# Altium schematic sheet POWER_REGULATORS_CARRIER.SchDoc: POWER REGULATORS
size A3; Author: Silvio Navaretti; CompanyName: ARDUINO; DrawnBy: Silvio Navaretti; Engineer: Silvio Navaretti; Organization: ARDUINO; SheetNumber: 40; SheetTotal: 51; RevAuthor: Silvio Navaretti
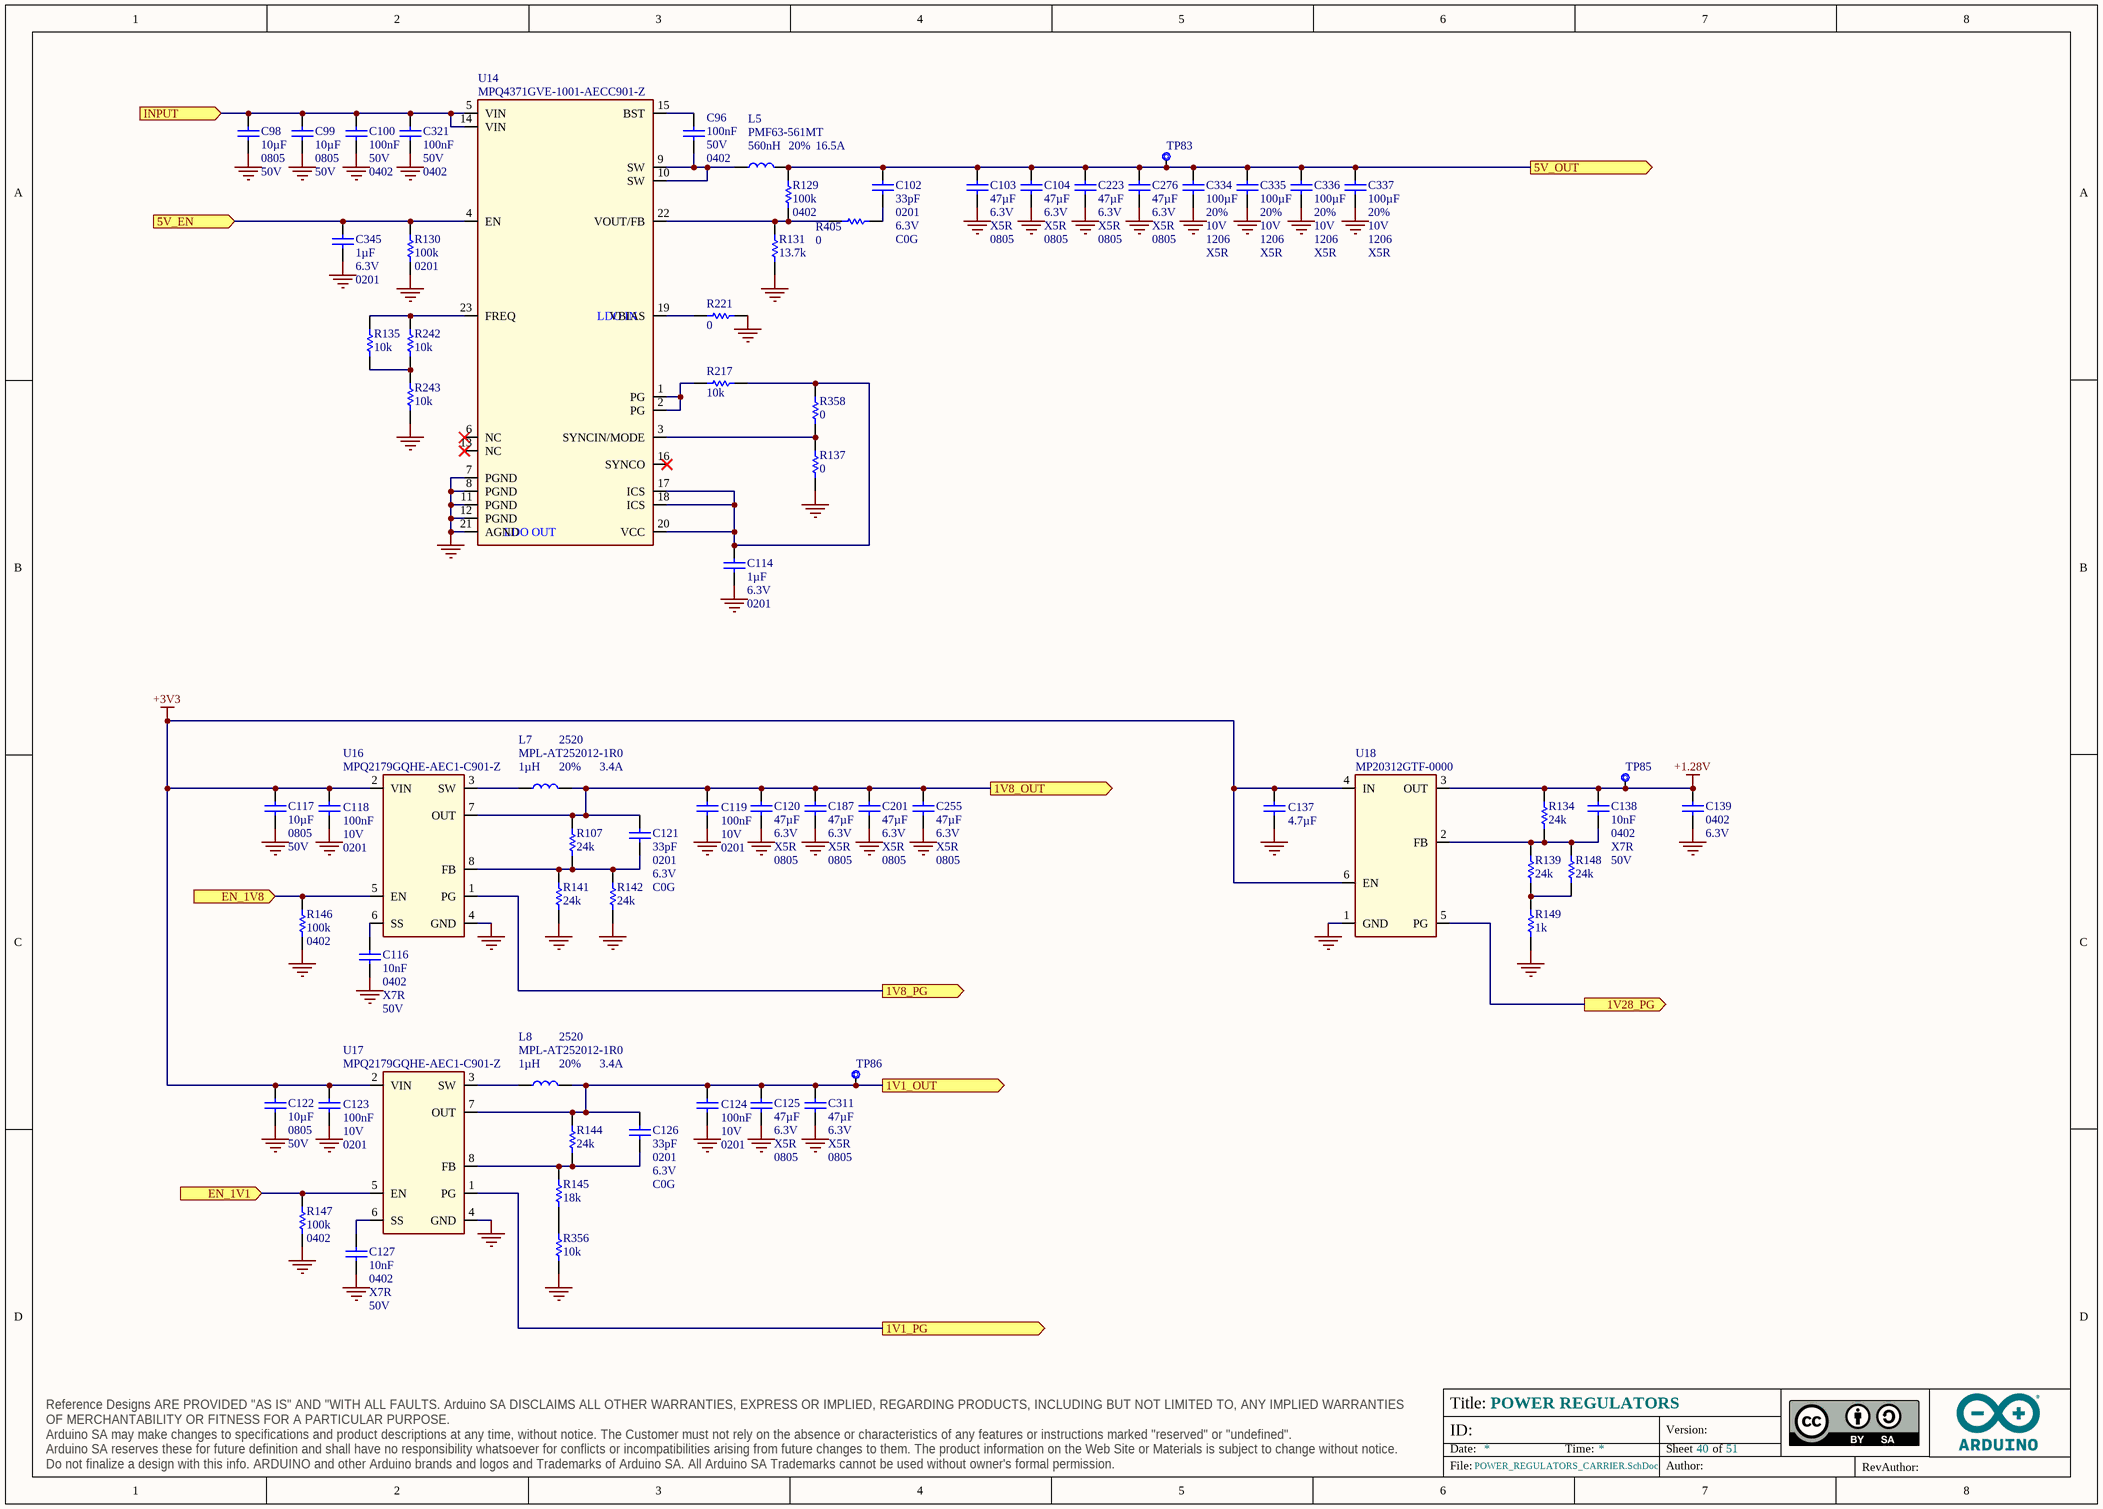
[diagram p0: POWER_REGULATORS_CARRIER.SchDoc]

## Parts
C96  value 100nF  Voltage: 50V  Case Code (Imperial): 0402  [CAP-0402]  (hidden comment: GRM155R61H104KE19D)
C98  value 10µF  Case Code (Imperial): 0805  Voltage: 50V  [CAP-0805]  (hidden comment: GRM21BR61H106ME43L)
C99  value 10µF  Case Code (Imperial): 0805  Voltage: 50V  [CAP-0805]  (hidden comment: GRM21BR61H106ME43L)
C100  value 100nF  Voltage: 50V  Case Code (Imperial): 0402  [CAP-0402]  (hidden comment: GRM155R61H104KE19D)
C102  value 33pF  Case Code (Imperial): 0201  Voltage: 6.3V  Dielectric: C0G  [CAP-0201]  (hidden comment: GJM0335C0J330JB01J)
C103  value 47µF  Voltage: 6.3V  Dielectric: X5R  Case Code (Imperial): 0805  [CAP-0805]  (hidden comment: C0805C476M9PAC7800)
C104  value 47µF  Voltage: 6.3V  Dielectric: X5R  Case Code (Imperial): 0805  [CAP-0805]  (hidden comment: C0805C476M9PAC7800)
C114  value 1µF  Voltage: 6.3V  Case Code (Imperial): 0201  [CAP-0201]  (hidden comment: GRM033R60J105MEA2D)
C116  value 10nF  Case Code (Imperial): 0402  Dielectric: X7R  Voltage: 50V  [CAP-0402]  (hidden comment: C1005B103K500NT)
C117  value 10µF  Case Code (Imperial): 0805  Voltage: 50V  [CAP-0805]  (hidden comment: GRM21BR61H106ME43L)
C118  value 100nF  Voltage: 10V  Case Code (Imperial): 0201  [CAP-0201]  (hidden comment: CL03A104KP3NNNC)
C119  value 100nF  Voltage: 10V  Case Code (Imperial): 0201  [CAP-0201]  (hidden comment: CL03A104KP3NNNC)
C120  value 47µF  Voltage: 6.3V  Dielectric: X5R  Case Code (Imperial): 0805  [CAP-0805]  (hidden comment: C0805C476M9PAC7800)
C121  value 33pF  Case Code (Imperial): 0201  Voltage: 6.3V  Dielectric: C0G  [CAP-0201]  (hidden comment: GJM0335C0J330JB01J)
C122  value 10µF  Case Code (Imperial): 0805  Voltage: 50V  [CAP-0805]  (hidden comment: GRM21BR61H106ME43L)
C123  value 100nF  Voltage: 10V  Case Code (Imperial): 0201  [CAP-0201]  (hidden comment: CL03A104KP3NNNC)
C124  value 100nF  Voltage: 10V  Case Code (Imperial): 0201  [CAP-0201]  (hidden comment: CL03A104KP3NNNC)
C125  value 47µF  Voltage: 6.3V  Dielectric: X5R  Case Code (Imperial): 0805  [CAP-0805]  (hidden comment: C0805C476M9PAC7800)
C126  value 33pF  Case Code (Imperial): 0201  Voltage: 6.3V  Dielectric: C0G  [CAP-0201]  (hidden comment: GJM0335C0J330JB01J)
C127  value 10nF  Case Code (Imperial): 0402  Dielectric: X7R  Voltage: 50V  [CAP-0402]  (hidden comment: C1005B103K500NT)
C137  value 4.7µF  [CAP-0402]  (hidden comment: C1005A475M6R3NT)
C138  value 10nF  Case Code (Imperial): 0402  Dielectric: X7R  Voltage: 50V  [CAP-0402]  (hidden comment: C1005B103K500NT)
C139  Case Code (Imperial): 0402  Voltage: 6.3V  [CAP-0402]  (hidden comment: C1005A475M6R3NT)
C187  value 47µF  Voltage: 6.3V  Dielectric: X5R  Case Code (Imperial): 0805  [CAP-0805]  (hidden comment: C0805C476M9PAC7800)
C201  value 47µF  Voltage: 6.3V  Dielectric: X5R  Case Code (Imperial): 0805  [CAP-0805]  (hidden comment: C0805C476M9PAC7800)
C223  value 47µF  Voltage: 6.3V  Dielectric: X5R  Case Code (Imperial): 0805  [CAP-0805]  (hidden comment: C0805C476M9PAC7800)
C255  value 47µF  Voltage: 6.3V  Dielectric: X5R  Case Code (Imperial): 0805  [CAP-0805]  (hidden comment: C0805C476M9PAC7800)
C276  value 47µF  Voltage: 6.3V  Dielectric: X5R  Case Code (Imperial): 0805  [CAP-0805]  (hidden comment: C0805C476M9PAC7800)
C311  value 47µF  Voltage: 6.3V  Dielectric: X5R  Case Code (Imperial): 0805  [CAP-0805]  (hidden comment: C0805C476M9PAC7800)
C321  value 100nF  Voltage: 50V  Case Code (Imperial): 0402  [CAP-0402]  (hidden comment: GRM155R61H104KE19D)
C334  value 100µF  Tolerance: 20%  Voltage: 10V  Case Code (Imperial): 1206  Dielectric: X5R  [CAP-1206]  (hidden comment: GRM31CR61A107MEA8L)
C335  value 100µF  Tolerance: 20%  Voltage: 10V  Case Code (Imperial): 1206  Dielectric: X5R  [CAP-1206]  (hidden comment: GRM31CR61A107MEA8L)
C336  value 100µF  Tolerance: 20%  Voltage: 10V  Case Code (Imperial): 1206  Dielectric: X5R  [CAP-1206]  (hidden comment: GRM31CR61A107MEA8L)
C337  value 100µF  Tolerance: 20%  Voltage: 10V  Case Code (Imperial): 1206  Dielectric: X5R  [CAP-1206]  (hidden comment: GRM31CR61A107MEA8L)
C345  value 1µF  Voltage: 6.3V  Case Code (Imperial): 0201  [CAP-0201]  (hidden comment: GRM033R60J105MEA2D)
L5  PMF63-561MT  Inductance: 560nH  IRMS: 16.5A  Tolerance: 20%  [PMF63]
L7  MPL-AT252012-1R0  Tolerance: 20%  Case Code (Metric): 2520  Inductance: 1µH  IRMS: 3.4A  [INDUCTOR 2520]
L8  MPL-AT252012-1R0  Tolerance: 20%  Case Code (Metric): 2520  Inductance: 1µH  IRMS: 3.4A  [INDUCTOR 2520]
R107  value 24k  [RES-0201]  (hidden comment: RC0201FR-0724KL)
R129  value 100k  Case Code (Imperial): 0402  [RES-0402]  (hidden comment: CRCW0402100KFKEDC)
R130  value 100k  Case Code (Imperial): 0201  [RES-0201]  (hidden comment: RC0201FR-07100KL)
R131  value 13.7k  [RES-0201]  (hidden comment: RC0201FR-0713K7L)
R134  value 24k  [RES-0201]  (hidden comment: RC0201FR-0724KL)
R135  value 10k  [RES-0201]  (hidden comment: RC0201FR-0710KL)
R137  value 0  [RES-0201]  (hidden comment: CRCW02010000Z0ED)
R139  value 24k  [RES-0201]  (hidden comment: RC0201FR-0724KL)
R141  value 24k  [RES-0201]  (hidden comment: RC0201FR-0724KL)
R142  value 24k  [RES-0201]  (hidden comment: RC0201FR-0724KL)
R144  value 24k  [RES-0201]  (hidden comment: RC0201FR-0724KL)
R145  value 18k  [RES-0201]  (hidden comment: RC0201FR-0718KL)
R146  value 100k  Case Code (Imperial): 0402  [RES-0402]  (hidden comment: CRCW0402100KFKEDC)
R147  value 100k  Case Code (Imperial): 0402  [RES-0402]  (hidden comment: CRCW0402100KFKEDC)
R148  value 24k  [RES-0201]  (hidden comment: RC0201FR-0724KL)
R149  value 1k  [RES-0201]  (hidden comment: RC0201FR-071KL)
R217  value 10k  [RES-0201]  (hidden comment: RC0201FR-0710KL)
R221  value 0  [RES-0201]  (hidden comment: CRCW02010000Z0ED)
R242  value 10k  [RES-0201]  (hidden comment: RC0201FR-0710KL)
R243  value 10k  [RES-0201]  (hidden comment: RC0201FR-0710KL)
R356  value 10k  [RES-0201]  (hidden comment: RC0201FR-0710KL)
R358  value 0  [RES-0201]  (hidden comment: CRCW02010000Z0ED)
R405  value 0  [RES-0201]  (hidden comment: CRCW02010000Z0ED)
TP83  Test point 1.00mm  [TP-1.00MM]  (value not drawn)  (no BOM)
TP85  Test point 1.00mm  [TP-1.00MM]  (value not drawn)  (no BOM)
TP86  Test point 1.00mm  [TP-1.00MM]  (value not drawn)  (no BOM)
U14  MPQ4371GVE-1001-AECC901-Z  [MPQ4371GVE-1001-AECC901-Z]
U16  MPQ2179GQHE-AEC1-C901-Z  [MPS QFN8 pitch 0.5mm 1.5x2x1mm]
U17  MPQ2179GQHE-AEC1-C901-Z  [MPS QFN8 pitch 0.5mm 1.5x2x1mm]
U18  MP20312GTF-0000  [SOT563]

## Ports
1V1_OUT (out), 1V1_PG (out), 1V8_OUT (out), 1V8_PG (out), 1V28_PG (out), 5V_EN (in), 5V_OUT (out), EN_1V1 (in), EN_1V8 (in), INPUT (in)

## Nets
+1.28V: C138.1 C139.1 R134.1 TP85.X U18.3(OUT)
+3V3: C117.2 C118.2 C122.2 C123.2 C137.2 U16.2(VIN) U17.2(VIN) U18.4(IN) U18.6(EN)
GND: C98.2 C99.2 C100.2 C103.1 C104.1 C114.1 C116.2 C117.1 C118.1 C119.1 C120.1 C122.1 C123.1 C124.1 C125.1 C127.2 C137.1 C139.2 C187.1 C201.1 C223.1 C255.1 C276.1 C311.1 C321.2 C334.2 C335.2 C336.2 C337.2 C345.1 R130.2 R131.1 R137.1 R141.1 R142.1 R146.2 R147.2 R149.2 R221.1 R243.1 R356.1 U14.7(PGND) U14.8(PGND) U14.11(PGND) U14.12(PGND) U14.21(AGND) U16.4(GND) U17.4(GND) U18.1(GND)
1V1_OUT: C124.2 C125.2 C126.2 C311.2 L8.2 R144.2 TP86.X U17.7(OUT) ; port 1V1_OUT
1V1_PG: U17.1(PG) ; port 1V1_PG
1V8_OUT: C119.2 C120.2 C121.2 C187.2 C201.2 C255.2 L7.2 R107.2 U16.7(OUT) ; port 1V8_OUT
1V8_PG: U16.1(PG) ; port 1V8_PG
1V28_PG: U18.5(PG) ; port 1V28_PG
5V_EN: C345.2 R130.1 U14.4(EN) ; port 5V_EN
5V_OUT: C102.2 C103.2 C104.2 C223.2 C276.2 C334.1 C335.1 C336.1 C337.1 L5.2 R129.1 TP83.X ; port 5V_OUT
EN_1V1: R147.1 U17.5(EN) ; port EN_1V1
EN_1V8: R146.1 U16.5(EN) ; port EN_1V8
INPUT: C98.1 C99.1 C100.1 C321.1 U14.5(VIN) U14.14(VIN) ; port INPUT
NetC96_1: C96.1 U14.15(BST)
NetC96_2: C96.2 L5.1 U14.9(SW) U14.10(SW)
NetC102_1: C102.1 R405.2
NetC114_2: C114.2 R217.1 R358.2 U14.17(ICS) U14.18(ICS) U14.20(VCC)
NetC116_1: C116.1 U16.6(SS)
NetC121_1: C121.1 R107.1 R141.2 R142.2 U16.8(FB)
NetC126_1: C126.1 R144.1 R145.2 U17.8(FB)
NetC127_1: C127.1 U17.6(SS)
NetC138_2: C138.2 R134.2 R139.2 R148.2 U18.2(FB)
NetL7_1: L7.1 U16.3(SW)
NetL8_1: L8.1 U17.3(SW)
NetR129_2: R129.2 R131.2 R405.1 U14.22(VOUT/FB)
NetR135_1: R135.1 R242.1 R243.2
NetR135_2: R135.2 R242.2 U14.23(FREQ)
NetR137_2: R137.2 R358.1 U14.3(SYNCIN/MODE)
NetR139_1: R139.1 R148.1 R149.1
NetR145_1: R145.1 R356.2
NetR217_2: R217.2 U14.1(PG) U14.2(PG)
NetR221_2: R221.2 U14.19(VBIAS)

Not connected (* = marked no-connect by the designer): U14 6(NC)* 13(NC)* 16(SYNCO)*

## Notes on the sheet
- Title:
- ID:
- Date:
- Time:
- Version:
- Sheet
- of
- RevAuthor:
- Reference Designs ARE PROVIDED "AS IS" AND "WITH ALL FAULTS. Arduino SA DISCLAIMS ALL OTHER WARRANTIES, EXPRESS OR IMPLIED, REGARDING PRODUCTS, INCLUDING BUT NOT LIMITED TO, ANY IMPLIED WARRANTIES OF MERCHANTABILITY OR FITNESS FOR A PARTICULAR PURPOSE.
  Arduino SA may make changes to specifications and product descriptions at any time, without notice. The Customer must not rely on the absence or characteristics of any features or instructions marked "reserved" or "undefined".
  Arduino SA reserves these for future definition and shall have no responsibility whatsoever for conflicts or incompatibilities arising from future changes to them. The product information on the Web Site or Materials is subject to change without notice.
  Do not finalize a design with this info. ARDUINO and other Arduino brands and logos and Trademarks of Arduino SA. All Arduino SA Trademarks cannot be used without owner's formal permission.
- File:
- Author:
- (in symbol U0503-A.7) LDO IN; LDO OUT

## Library data of the parts
C96 C100 C321 = C0015-A.14: CAP CHIP 0402 100nF 10% 50V X5R; Manufacturer: Murata; Code Arduino: A5141; Part Number: GRM155R61H104KE19D; Dielectric: X5R; Tolerance: 10%; Technology: Ceramic
C98 C99 C117 C122 = C0158-A.3: CAP CHIP 0805 10uF 20% 50V X5R; Manufacturer: Murata Electronics; Code Arduino: C0158; Tolerance: 20%; Dielectric: X5R; Technology: SMD; Part Number: GRM21BR61H106ME43L
C102 C121 C126 = C0114-A.6: CAP CHIP 0201 33pF 5% 6.3V C0G; Manufacturer: Murata Electronics; Code Arduino: C0114; Technology: Ceramic; Tolerance: 5%; Part Number: GJM0335C0J330JB01J
C103 C104 C120 C125 C187 C201 C223 C255 C276 C311 = C0199-A.1: CAP CHIP 0805 47uF 20% 6.3V X5R; Manufacturer: KEMET; Code Arduino: C0199; Technology: Ceramic; Tolerance: 20%; Part Number: C0805C476M9PAC7800
C114 C345 = C0002-A.15: CAP CHIP 0201 1uF 20% 6.3V X5R; Manufacturer: Murata; Code Arduino: A5520; Tolerance: 20%; Dielectric: X5R; Part Number: GRM033R60J105MEA2D; Technology: Ceramic
C116 C127 C138 = C0009-A.15: CAP CHIP 0402 10nF 10% 50V X7R; Manufacturer: Hottech; Code Arduino: 0165; Manufacturer 2: Murata Electronics; Part Number: C1005B103K500NT; Tolerance: 10%; Part number 2: CC0402KRX7R9BB103; Manufacturer 3: YAGEO; Technology: Ceramic
C118 C119 C123 C124 = C0113-A.6: CAP CHIP 0201 100nF 10% 10V X5R; Manufacturer: Samsung Electro-Mechanics; Code Arduino: C0113; Technology: Ceramic; Part Number: CL03A104KP3NNNC; Dielectric: X5R; Tolerance: 10%
C137 = C0037-A.14: CAP CHIP 0402 4.7uF 20% 6V3 X5R; Manufacturer: Hottech; Code Arduino: 0833; Voltage: 6.3V; Dielectric: X5R; Technology: Ceramic; Part Number: C1005A475M6R3NT; Manufacturer 2: Samsung Electro-Mechanics; Case Code (Imperial): 0402; Tolerance: 20%; Manufacturer 3: Murata Electronics; Part number 3: GRM155R60J475ME47D; Part number 2: CL05A475KQ5NRNC
C139 = C0037-A.14: CAP CHIP 0402 4.7uF 20% 6V3 X5R; Manufacturer: Hottech; Value: 4.7µF; Code Arduino: 0833; Dielectric: X5R; Technology: Ceramic; Part Number: C1005A475M6R3NT; Manufacturer 2: Samsung Electro-Mechanics; Tolerance: 20%; Manufacturer 3: Murata Electronics; Part number 3: GRM155R60J475ME47D; Part number 2: CL05A475KQ5NRNC
C334-C337 = C0166-A.1: CAP CHIP 1206 100uF 20% 10V X5R; Manufacturer: Murata; Code Arduino: C0166; Datasheet: https://www.mouser.it/datasheet/2/281/1/GRM31CR61A107MEA8_01A-1987899.pdf; Technology: Thick film; Part Number: GRM31CR61A107MEA8L
L5 = I0124-A.1: IND 0.56uH 20%, max 5mR, IRMS 16.5A, Isat 25.5A, 7.3x6.6x3mm; Manufacturer: K-WELL; Code Arduino: I0124; DCR max: 5m; ISAT: 25.5A; Part Number: PMF63-561MT; Case Code (Metric): 7.3x6.6x3mm; Max Operating Temperature: 125°C; ComponentLink1URL: http://www.kw-magnetics.com/index.php?m=content&c=index&a=show&catid=162&id=294
L7 L8 = I0127-A.3: IND SMD 1uH 20% ISAT 4.5A IRMS 3.4A 55mR MAX 2.5x2.1.2mm; Manufacturer: MPS; DCR max: 55m; Code Arduino: I0127; Resonant frequency: 88MHz; ISAT: 4.5A; Max Operating Temperature: 125°C; Part Number: MPL-AT252012-1R0
R107 R139 R141 R142 R144 R148 = R0398-A.1: RES CHIP 0201 24k 1% 1/20W; Manufacturer: YAGEO; Power: 50mW; Code Arduino: R0398; Temperature Coefficient: 200ppm; Case Code (Imperial): 0201; Part Number: RC0201FR-0724KL; Technology: Thick film; Tolerance: 1%
R129 R146 R147 = R0001-A.24: RES CHIP 0402 100k 1% 1/16W; Manufacturer: Vishay; Power: 62.5mW; Code Arduino: 0134; Temperature coefficient: 100ppm; Tolerance: 1%; Part Number: CRCW0402100KFKEDC; Technology: Thick film
R130 = R0146-A.21: RES CHIP 0201 100k 1% 1/20W; Manufacturer: Yageo; Power: 50mW; Code Arduino: R0146; Temperature coefficient: 200ppm; Tolerance: 1%; Manufacturer 2: Samsung Electro-Mechanics; Part Number: RC0201FR-07100KL; Technology: Thick film
R131 = R0395-A.1: RES CHIP 0201 13k7 1% 1/20W; Manufacturer: YAGEO; Power: 50mW; Temperature Coefficient: 200ppm; Code Arduino: R0395; Technology: Thick film; Case Code (Imperial): 0201; Tolerance: 1%; Part Number: RC0201FR-0713K7L
R134 = R0398-A.1: RES CHIP 0201 24k 1% 1/20W; Manufacturer: YAGEO; Power: 50mW; Temperature Coefficient: 200ppm; Code Arduino: R0398; Tolerance: 1%; Case Code (Imperial): 0201; Part Number: RC0201FR-0724KL; Technology: Thick film
R135 R242 R243 = R0145-A.21: RES CHIP 0201 10k 1% 1/20W; Manufacturer: Yageo; Power: 50mW; Temperature coefficient: 200ppm; Code Arduino: R0145; Manufacturer 2: Samsung Electro-Mechanics; Tolerance: 1%; Case Code (Imperial): 0201; Part Number: RC0201FR-0710KL; Technology: Thick film
R137 R221 R358 R405 = R0140-A.21: RES CHIP 0201 0R; Manufacturer: Vishay; Temperature coefficient: 0ppm; Code Arduino: R0140; Power: 50mW; Tolerance: 0%; Technology: Thick film; Case Code (Imperial): 0201; Part Number: CRCW02010000Z0ED
R145 = R0399-A.1: RES CHIP 0201 18k 1% 1/20W; Manufacturer: YAGEO; Power: 50mW; Code Arduino: R0399; Temperature Coefficient: 200ppm; Case Code (Imperial): 0201; Part Number: RC0201FR-0718KL; Technology: Thick film; Tolerance: 1%
R149 = R0195-A.22: RES CHIP 0201 1k 1% 1/20W; Manufacturer: Yageo; Power: 50mW; Temperature coefficient: 200ppm; Code Arduino: R0195; Part Number: RC0201FR-071KL; Tolerance: 1%; Case Code (Imperial): 0201; Technology: Thick film
R217 = R0145-A.21: RES CHIP 0201 10k 1% 1/20W; Manufacturer: Yageo; Temperature coefficient: 200ppm; Code Arduino: R0145; Power: 50mW; Technology: Thick film; Manufacturer 2: Samsung Electro-Mechanics; Case Code (Imperial): 0201; Part Number: RC0201FR-0710KL; Tolerance: 1%
R356 = R0145-A.21: RES CHIP 0201 10k 1% 1/20W; Manufacturer: Yageo; Power: 50mW; Code Arduino: R0145; Temperature coefficient: 200ppm; Manufacturer 2: Samsung Electro-Mechanics; Case Code (Imperial): 0201; Part Number: RC0201FR-0710KL; Technology: Thick film; Tolerance: 1%
TP83 TP85 TP86 = UT0013-A.6: Part Number: This is not a component; Design Item ID: CMP-018-0005-A.3; Source: ut.SchLib; Manufacturer: This is not a component; Code Arduino: This is not a component; Pin Count: 1
U14 = U0503-A.7: IC Buck Vin 36V, Vout ADJ, Iout max 11A, with FSS, multi phase, QFN23 4x5mm; Manufacturer: MPS; Code Arduino: U0503; Part Number: MPQ4371GVE-1001-AECC901-Z
U16 U17 = U0504-A.5: IC Buck Vin 5.5V, Vout ADJ, Iout max 3A, fsw 2.4MHz, QFN8 2x1.5mm; Manufacturer: MPS; Code Arduino: U0504; Part Number: MPQ2179GQHE-AEC1-C901-Z
U18 = U0496-A.5: IC LDO, Vin 1.6V - 5.5V, Vout ADJ, Iout 0.5A, SOT563 1.6x1.6mm; Manufacturer: MPS; Code Arduino: U0496; Part Number: MP20312GTF-0000